# Altium schematic sheet filterdesing.SchDoc
size A
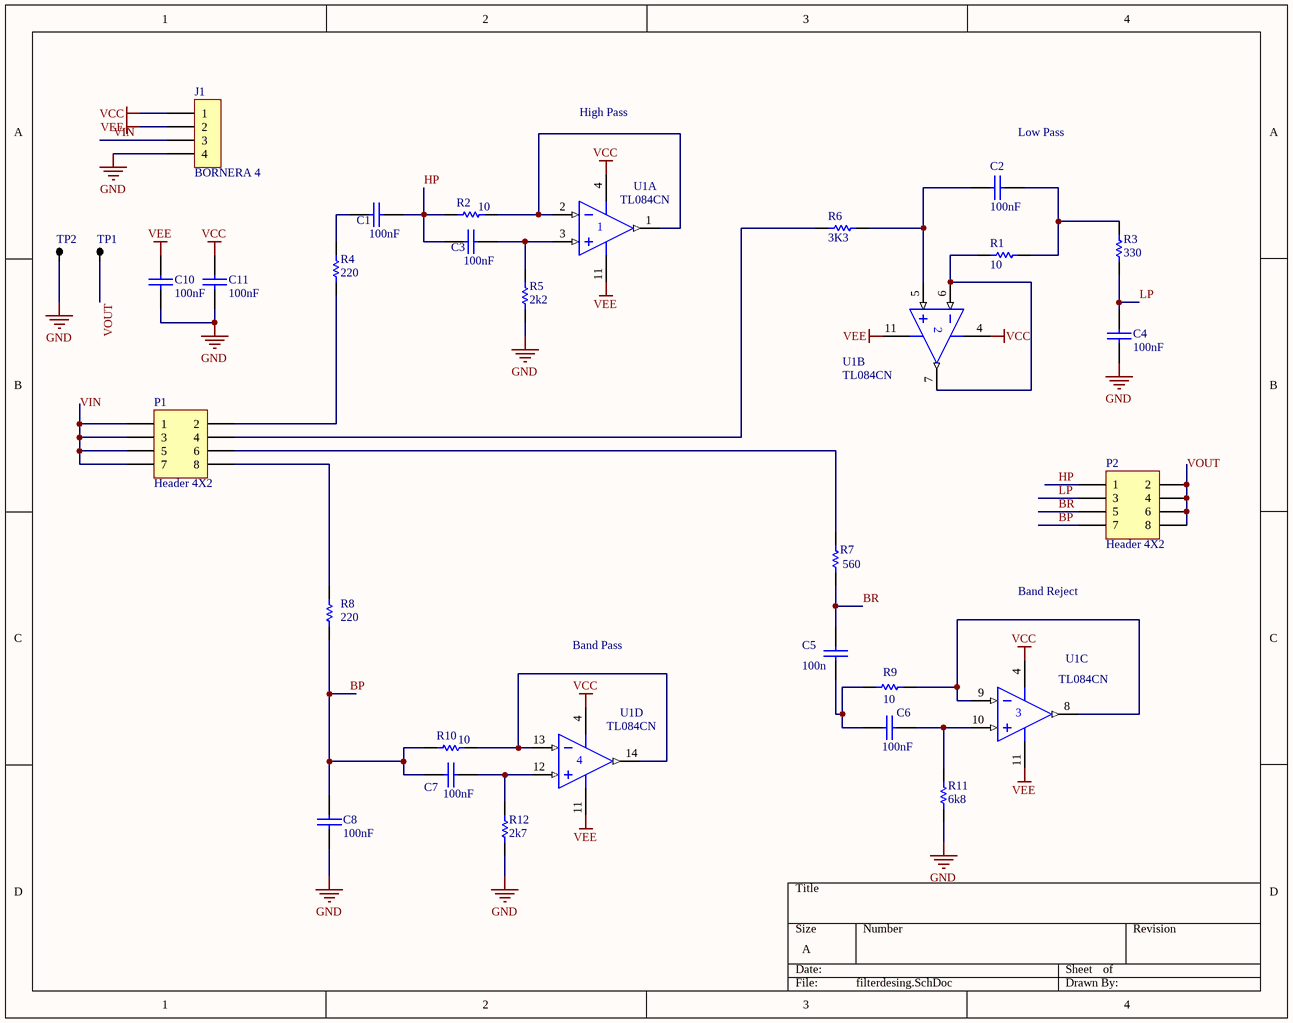
[diagram p0: filterdesing.SchDoc]

## Parts
C1  100nF  [CAP200]
C2  100nF  [CAP200]
C3  100nF  [CAP200]
C4  100nF  [CAP200]
C5  100n  [CAP200]
C6  100nF  [CAP200]
C7  100nF  [CAP200]
C8  100nF  [CAP200]
C10  100nF  [CAP200]
C11  100nF  [CAP200]
J1  BORNERA 4  [BORNERA4]
P1  Header 4X2  [HDR2X4]
P2  Header 4X2  [HDR2X4]
R1  10  [RES400]
R2  10  [RES400]
R3  330  [RES400]
R4  220  [RES400]
R5  2k2  [RES400]
R6  3K3  [RES400]
R7  560  [RES400]
R8  220  [RES400]
R9  10  [RES400]
R10  10  [RES400]
R11  6k8  [RES400]
R12  2k7  [RES400]
TP1  (no value)  [TPTH]
TP2  (no value)  [TPTH]
U1  TL084CN  [646-06]  (parts A,B,C,D of 4)

## Nets
GND: C4.1 C8.1 C10.1 C11.1 J1.4 R5.1 R11.2 R12.1 TP2.1
VCC: C11.2 J1.1 U1.4(V+)
VEE: C10.2 J1.2 U1.11(V-)
BP: C7.1 C8.2 P2.7 R8.1 R10.2
BR: C5.2 P2.5 R7.1
HP: C1.2 C3.1 P2.1 R2.1
LP: C4.2 P2.3 R3.2
VIN: J1.3 P1.1 P1.3 P1.5 P1.7
VOUT: P2.2 P2.4 P2.6 P2.8 TP1.1
NetC1_1: C1.1 R4.2
NetC2_1: C2.1 R6.2 U1.5(IN+)
NetC2_2: C2.2 R1.1 R3.1
NetC3_2: C3.2 R5.2 U1.3(IN+)
NetC5_1: C5.1 C6.1 R9.1
NetC6_2: C6.2 R11.1 U1.10(IN+)
NetC7_2: C7.2 R12.2 U1.12(IN+)
NetP1_2: P1.2 R4.1
NetP1_4: P1.4 R6.1
NetP1_6: P1.6 R7.2
NetP1_8: P1.8 R8.2
NetR1_2: R1.2 U1.6(IN-) U1.7(OUT)
NetR2_2: R2.2 U1.1(OUT) U1.2(IN-)
NetR9_2: R9.2 U1.8(OUT) U1.9(IN-)
NetR10_1: R10.1 U1.13(IN-) U1.14(OUT)

## Notes on the sheet
- High Pass
- (near C2) Low Pass
- Band Reject
- Band Pass

## Library data of the parts
C1-C8 C10 C11 = CAP
P1 P2 = Header 4X2: Header, 4-Pin, Dual row; LatestRevisionDate: 17-Jul-2002; LatestRevisionNote: Re-released for DXP Platform.; Publisher: Altium Limited
R1-R12 = RES
TP1 TP2 = TP
U1 = TL084CN: JFET-Input Operational Amplifier; Published: 17-Jul-2002; LatestRevisionDate: 06-Jun-2005; LatestRevisionNote: Stylized 3D Model Added.; DatasheetVersion: 1988; PackageVersion: 1997; PackageReference: 646-06; Publisher: Altium Limited; PackageDescription: DIP; 14 Leads; Row Spacing 7.62 mm; Pitch 2.54 mm; ComponentLink1Description: Manufacturer Link; ComponentLink1URL: http://www.onsemi.com/site/products/parametrics/0,4446,251,00.html